# EAGLE design MoodLightv21 (EAGLE 5.04)
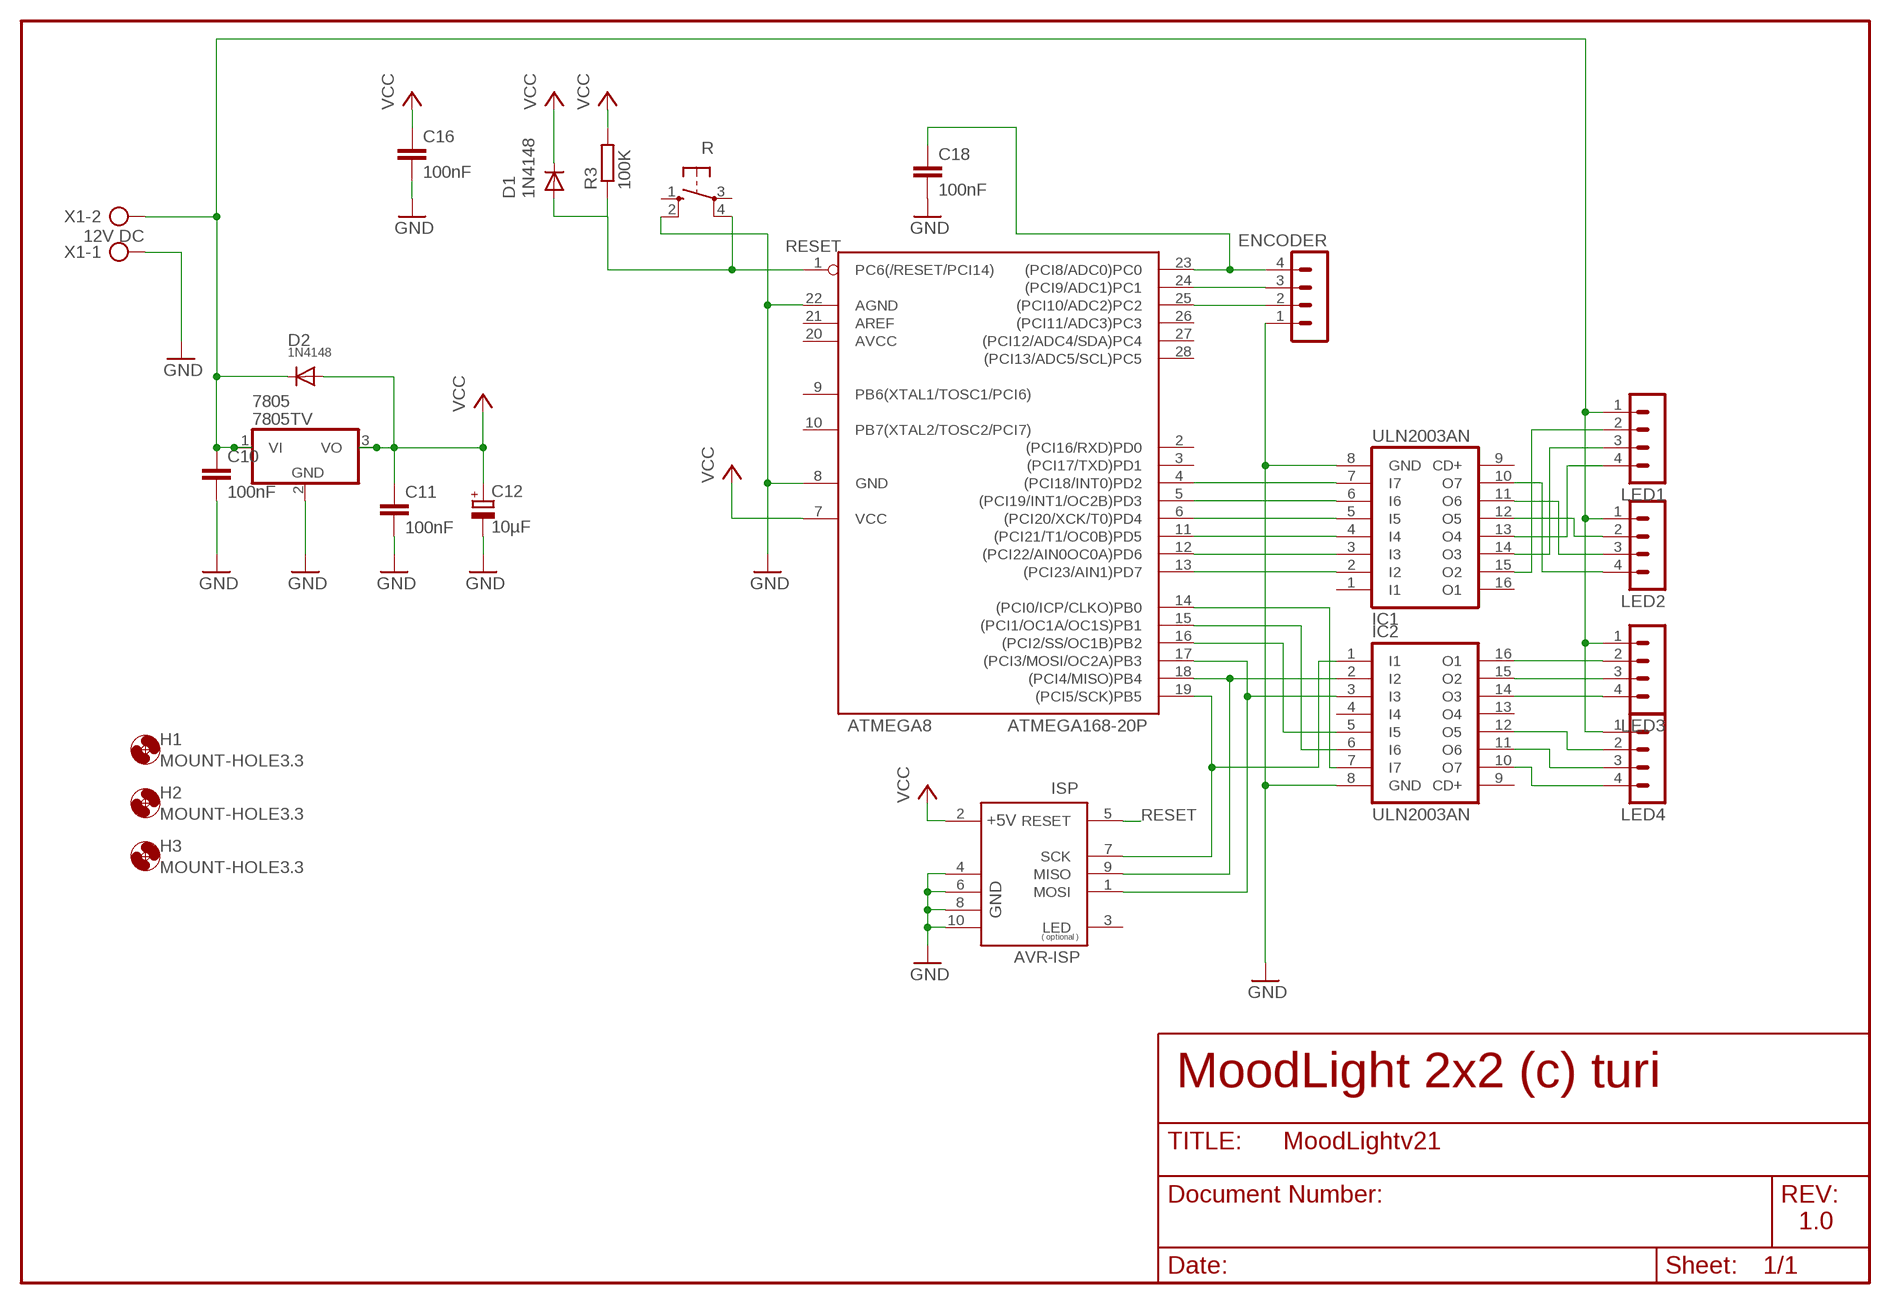
[diagram p0: schematic, sheet 1]

## Parts
7805  7805TV  [TO220V]
ATMEGA8  ATMEGA168-20P  [DIL28-3]
C10  100nF  C-EU025-024X044  [C025-024X044]
C11  100nF  C-EU025-024X044  [C025-024X044]
C12  10µF  CPOL-EUE2.5-5  [E2,5-5]
C16  100nF  C-EU025-024X044  [C025-024X044]
C18  100nF  C-EU025-024X044  [C025-024X044]
D1  1N4148  [DO35-10]
D2  1N4148  BAS15  [DO34-7]
ENCODER  MA04-1  [MA04-1]
H1  MOUNT-HOLE3.3  [3,3]
H2  MOUNT-HOLE3.3  [3,3]
H3  MOUNT-HOLE3.3  [3,3]
IC1  ULN2003AN  [DIL16]
IC2  ULN2003AN  [DIL16]
ISP  AVR-ISP  [ML10]
LED1  MA04-1  [MA04-1]
LED2  MA04-1  [MA04-1]
LED3  MA04-1  [MA04-1]
LED4  MA04-1  [MA04-1]
R  10-XX  [B3F-10XX]
R3  100K  R-EU_0207/10  [0207/10]
X1  12V DC  AK500/2  [AK500/2]

## Nets
GND: 7805.2(GND) ATMEGA8.8(GND) ATMEGA8.22(AGND) C10.2 C11.2 C12.- C16.2 C18.2 ENCODER.1 IC1.8(GND) IC2.8(GND) ISP.4(GND1) ISP.6(GND2) ISP.8(GND3) ISP.10(GND4) R.2(S1) X1.1
MISO: ATMEGA8.18((PCI4/MISO)PB4) IC2.2(I2) ISP.9(MISO)
MOSI: ATMEGA8.17((PCI3/MOSI/OC2A)PB3) IC2.3(I3) ISP.1(MOSI)
N$1: ATMEGA8.14((PCI0/ICP/CLKO)PB0) IC2.7(I7)
N$2: ATMEGA8.23((PCI8/ADC0)PC0) C18.1 ENCODER.4
N$3: ATMEGA8.15((PCI1/OC1A/OC1S)PB1) IC2.6(I6)
N$4: ATMEGA8.4((PCI18/INT0)PD2) IC1.7(I7)
N$5: ATMEGA8.5((PCI19/INT1/OC2B)PD3) IC1.6(I6)
N$6: ATMEGA8.6((PCI20/XCK/T0)PD4) IC1.5(I5)
N$7: ATMEGA8.11((PCI21/T1/OC0B)PD5) IC1.4(I4)
N$8: ATMEGA8.13((PCI23/AIN1)PD7) IC1.2(I2)
N$10: ATMEGA8.16((PCI2/SS/OC1B)PB2) IC2.5(I5)
N$11: 7805.1(VI) C10.1 D2.C LED1.1 LED2.1 LED3.1 LED4.1 X1.2
N$12: IC1.15(O2) LED1.2
N$13: IC1.14(O3) LED1.3
N$14: IC1.13(O4) LED1.4
N$15: IC1.12(O5) LED2.2
N$16: IC1.11(O6) LED2.3
N$17: IC1.10(O7) LED2.4
N$18: IC2.16(O1) LED3.2
N$19: IC2.15(O2) LED3.3
N$20: ATMEGA8.12((PCI22/AIN0OC0A)PD6) IC1.3(I3)
N$21: IC2.14(O3) LED3.4
N$22: IC2.12(O5) LED4.2
N$23: IC2.11(O6) LED4.3
N$24: IC2.10(O7) LED4.4
N$25: ATMEGA8.24((PCI9/ADC1)PC1) ENCODER.3
N$26: ATMEGA8.25((PCI10/ADC2)PC2) ENCODER.2
RESET: ATMEGA8.1(PC6(/RESET/PCI14)) D1.A ISP.5(RESET) R3.1 R.4(P1)
SCK: ATMEGA8.19((PCI5/SCK)PB5) IC2.1(I1) ISP.7(SCK)
VCC: 7805.3(VO) ATMEGA8.7(VCC) C11.1 C12.+ C16.1 D1.C D2.A ISP.2(+5V) R3.2
Unconnected: ATMEGA8.2((PCI16/RXD)PD0) ATMEGA8.3((PCI17/TXD)PD1) ATMEGA8.9(PB6(XTAL1/TOSC1/PCI6)) ATMEGA8.10(PB7(XTAL2/TOSC2/PCI7)) ATMEGA8.20(AVCC) ATMEGA8.21(AREF) ATMEGA8.26((PCI11/ADC3)PC3) ATMEGA8.27((PCI12/ADC4/SDA)PC4) ATMEGA8.28((PCI13/ADC5/SCL)PC5) IC1.1(I1) IC1.9(CD+) IC1.16(O1) IC2.4(I4) IC2.9(CD+) IC2.13(O4) R.1(S) R.3(P)

## Notes on the sheet
- MoodLight 2x2 (c) turi
- 1.0

## Power pins joined to a net without a drawn wire
LED: ISP.3(LED)

## Library data of the parts
7805 = linear:78*: Positive VOLTAGE REGULATOR Source: http://cache.national.com/ds/LM/LM78L05.pdf http://www.fairchildsemi.com/ds/LM/LM7805.pdf
ATMEGA8 = avr:ATMEGA168*P: MICROCONTROLLER 16 kBytes FLASH 1 kBytes SRAM 512 Bytes EEPROM USART 8-channel 10 bit ADC
C10 C11 C16 C18 = rcl:C-EU: CAPACITOR, European symbol
C12 = rcl:CPOL-EU: POLARIZED CAPACITOR, European symbol
D1 = diode:1N4148: DIODE high speed (Philips)
D2 = diode:BAS15: DIODE high speed
ENCODER LED1-LED4 = con-lstb:MA04-1: PIN HEADER
H1-H3 = holes:MOUNT-HOLE: MOUNTING HOLE with drill center marker
IC1 IC2 = uln-udn:ULN2003A: DRIVER ARRAY
ISP = roboternetz-definitionen:AVR-ISP
R = switch-omron:10-XX: OMRON SWITCH
R3 = rcl:R-EU_: RESISTOR, European symbol
X1 = con-ptr500:AK500/2: CONNECTOR

## Board
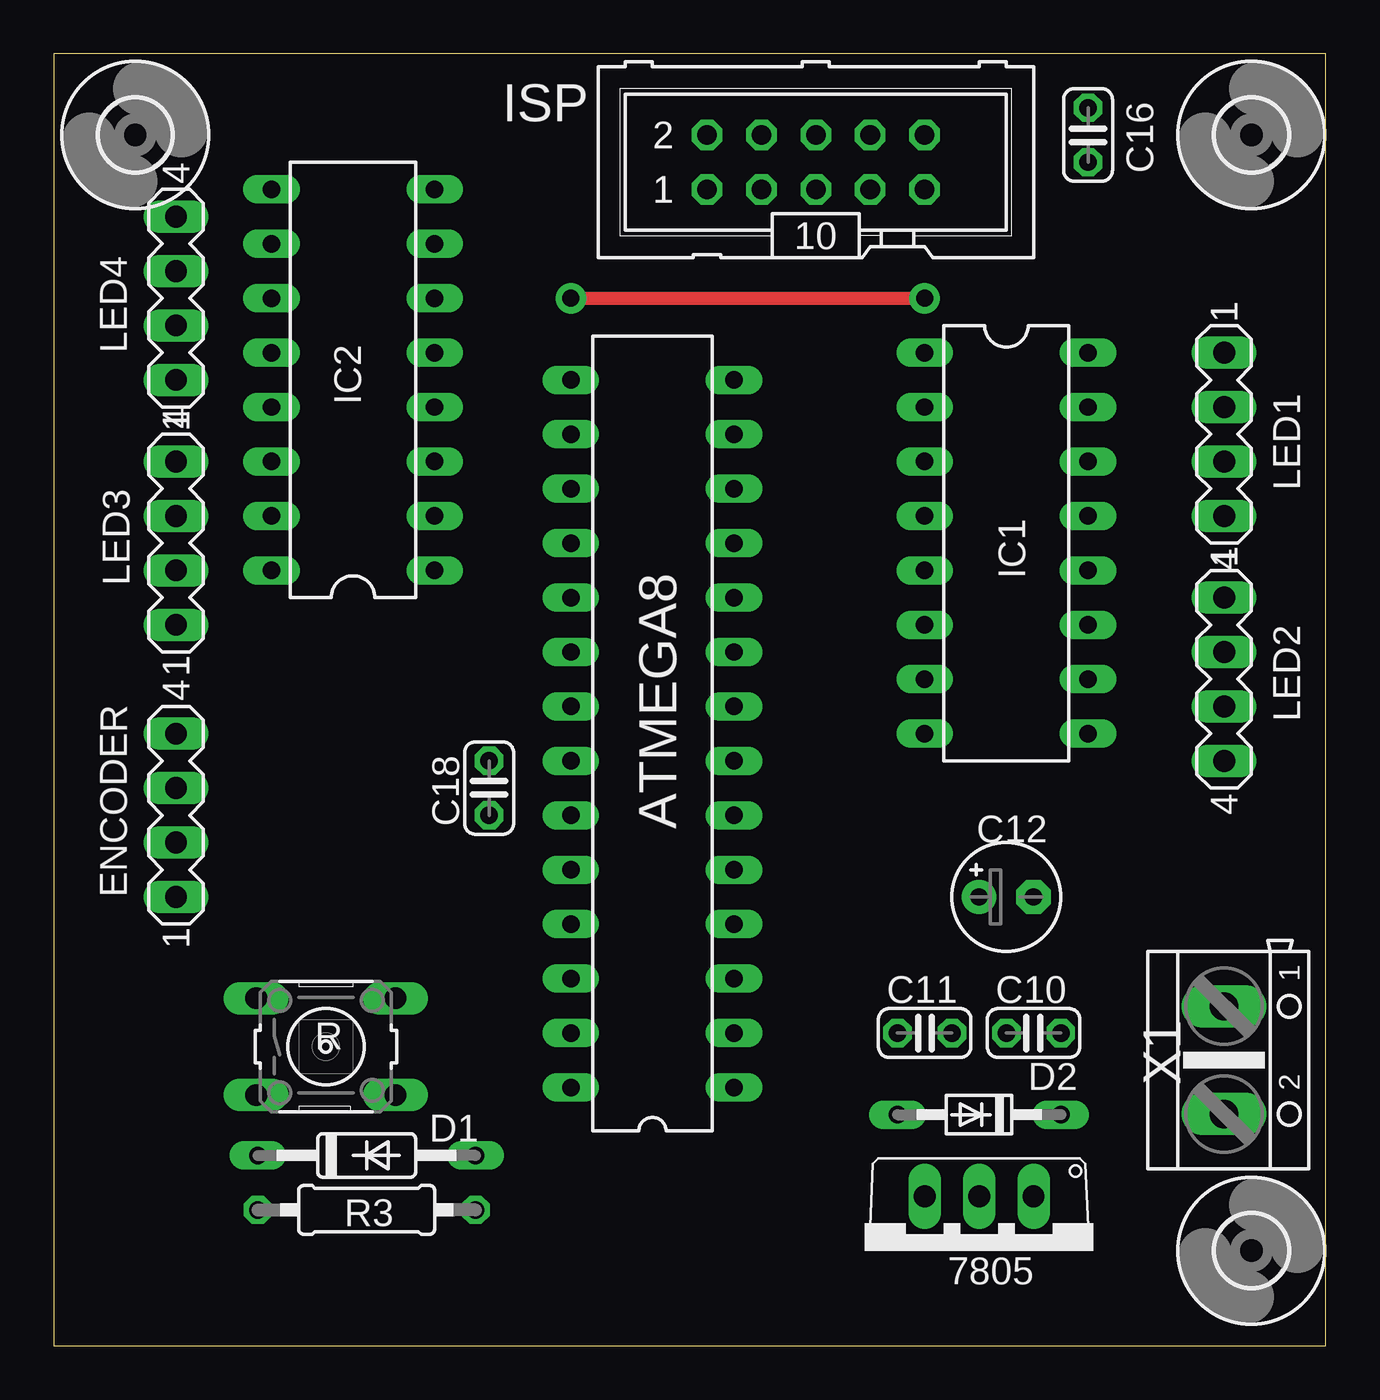
[diagram p1: board, top side]
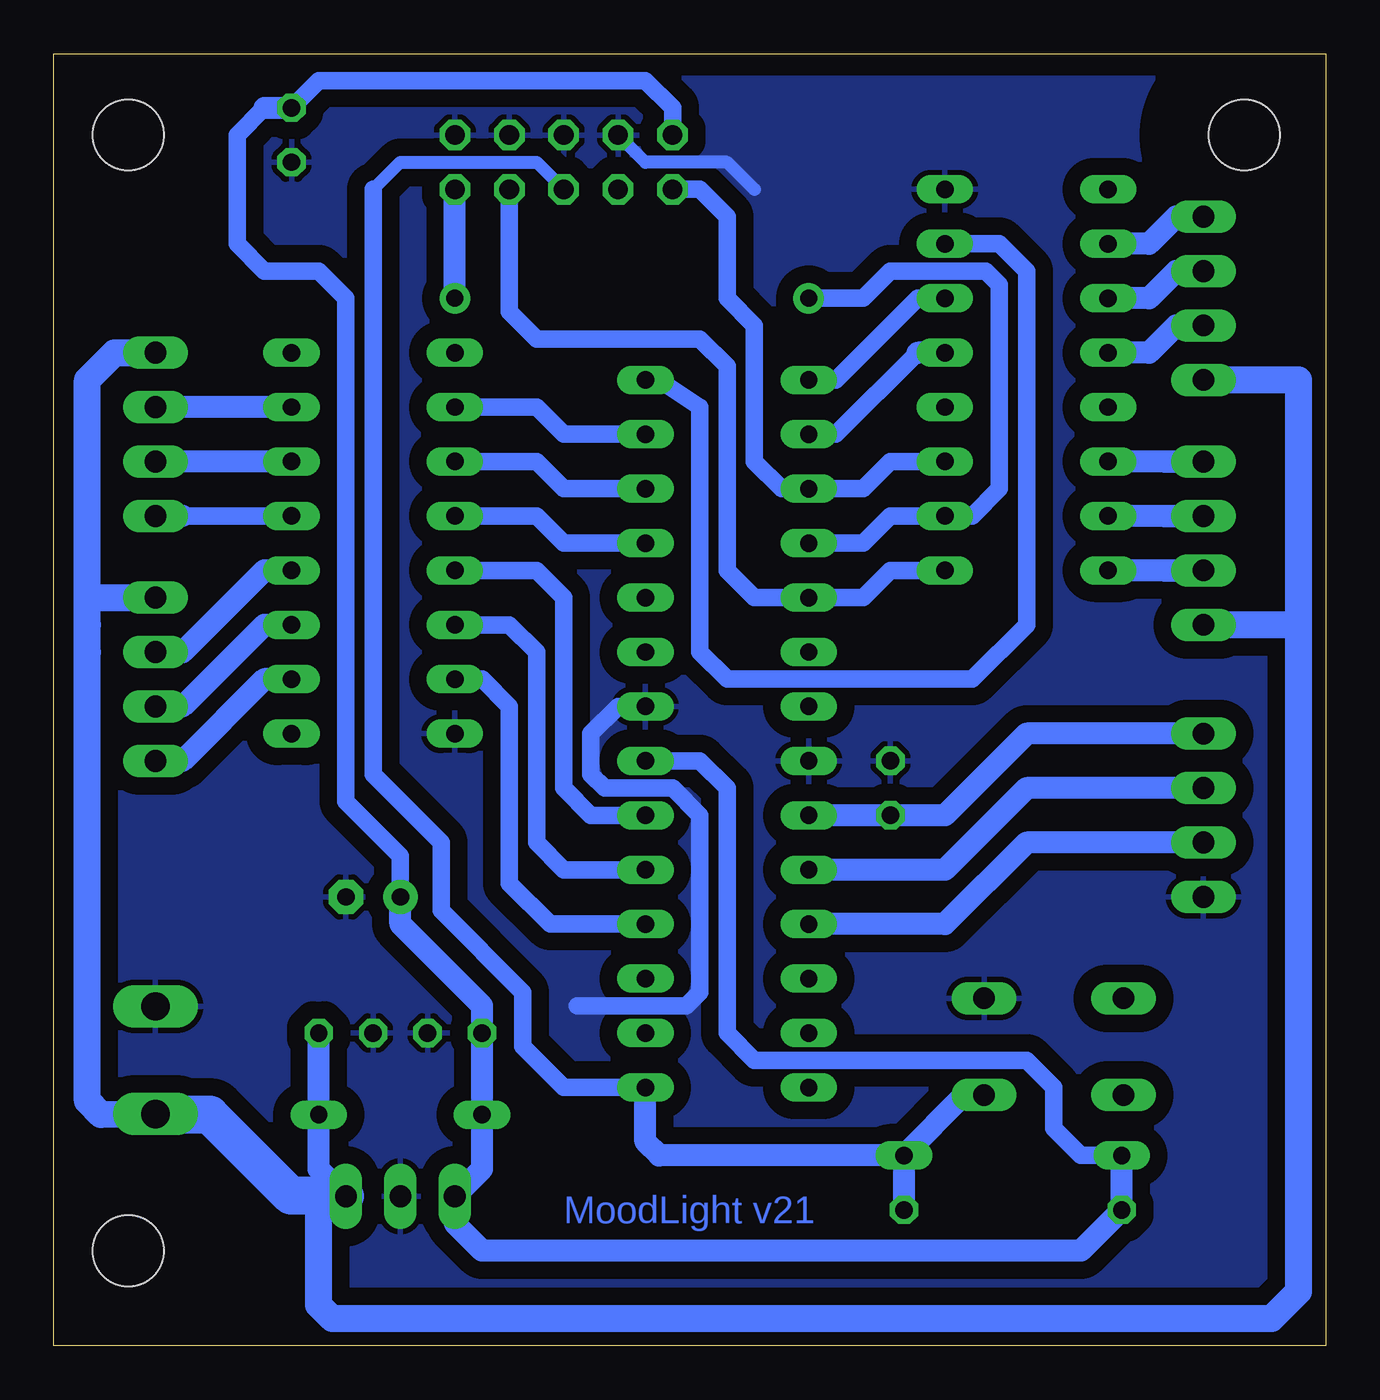
[diagram p2: board, bottom side, seen from below]

Size 59.36 x 60.31 mm. Coordinates in mm from the lower left corner, seen from the top.
Outline: 0,0 59.36,0 59.36,60.31 0,60.31 0,0
Copper layers (1*16): Top 0.035mm / dielectric 1.5mm / Bottom 0.035mm
Design rules "default": minimum track width 10mil, minimum drill 24mil, track to track 8mil, track to pad 8mil, pad to pad 8mil, via to via 8mil, smd to smd 8mil, copper to edge 40mil, drill to drill 8mil, minimum pad ring 10mil, minimum via ring 8mil, stop-mask expansion 4mil, vias tented up to drill 0mil, thermal gap 10mil

### Footprints (pad centres in the part's own frame; a part is rotated, then mirrored left to right if it is on the bottom)
TO220V = drill 1.016 long: 1 -2.54,-2.54; 2 0,-2.54; 3 2.54,-2.54
DIL28-3 = drill 0.813 long: 1 -16.51,-3.81; 2 -13.97,-3.81; 3 -11.43,-3.81; 4 -8.89,-3.81; 5 -6.35,-3.81; 6 -3.81,-3.81; 7 -1.27,-3.81; 8 1.27,-3.81; 9 3.81,-3.81; 10 6.35,-3.81; 11 8.89,-3.81; 12 11.43,-3.81; 13 13.97,-3.81; 14 16.51,-3.81; 15 16.51,3.81; 16 13.97,3.81; 17 11.43,3.81; 18 8.89,3.81; 19 6.35,3.81; 20 3.81,3.81; 21 1.27,3.81; 22 -1.27,3.81; 23 -3.81,3.81; 24 -6.35,3.81; 25 -8.89,3.81; 26 -11.43,3.81; 27 -13.97,3.81; 28 -16.51,3.81
C025-024X044 = drill 0.813 octagon: 1 -1.27,0; 2 1.27,0
E2,5-5 = drill 0.813 pad 1.6 round: + -1.27,0 | drill 0.813 pad 1.6 octagon: - 1.27,0
DO35-10 = drill 0.813 long: A 5.08,0; C -5.08,0
DO34-7 = drill 0.813 long: A 3.81,0; C -3.81,0
MA04-1 = drill 1.016 long: 1 -3.81,0; 2 -1.27,0; 3 1.27,0; 4 3.81,0
3,3 = hole 3.3: 0,0
DIL16 = drill 0.813 long: 1 -8.89,-3.81; 2 -6.35,-3.81; 3 -3.81,-3.81; 4 -1.27,-3.81; 5 1.27,-3.81; 6 3.81,-3.81; 7 6.35,-3.81; 8 8.89,-3.81; 9 8.89,3.81; 10 6.35,3.81; 11 3.81,3.81; 12 1.27,3.81; 13 -1.27,3.81; 14 -3.81,3.81; 15 -6.35,3.81; 16 -8.89,3.81
ML10 = drill 0.914 octagon: 1 -5.08,-1.27; 2 -5.08,1.27; 3 -2.54,-1.27; 4 -2.54,1.27; 5 0,-1.27; 6 0,1.27; 7 2.54,-1.27; 8 2.54,1.27; 9 5.08,-1.27; 10 5.08,1.27
B3F-10XX = drill 1.016 long: 1 -3.251,2.261; 2 3.251,2.261; 3 -3.251,-2.261; 4 3.251,-2.261
0207/10 = drill 0.813 octagon: 1 -5.08,0; 2 5.08,0
AK500/2 = drill 1.321 long: 1 -2.515,0; 2 2.515,0

### Placement (x,y rotation side)
7805  43.18,4.44 180 top
ATMEGA8  27.94,28.58 90 top
C10  45.72,14.61 180 top
C11  40.64,14.61 0 top
C12  44.45,20.96 0 top
C16  48.26,56.52 270 top
C18  20.32,26.04 90 top
D1  14.61,8.89 0 top
D2  43.18,10.8 180 top
ENCODER  5.71,24.77 90 top
H1  3.81,56.52 0 top
H2  55.88,4.44 0 top
H3  55.88,56.52 0 top
IC1  44.45,37.47 270 top
IC2  13.97,45.09 90 top
ISP  35.56,55.24 0 top
LED1  54.61,42.55 270 top
LED2  54.61,31.12 270 top
LED3  5.71,37.47 90 top
LED4  5.71,48.9 90 top
R  12.7,13.97 0 top
R3  14.61,6.35 180 top
X1  54.61,13.34 270 top

### Tracks (layer width: path | path; a pad name or v marks a point on that pad's centre or on a via)
GND
  Bottom 0.61: ISP.4 31.75,55.24 27.94,55.24 26.67,53.98
  Bottom 0.813: ATMEGA8.8 33.02,29.84 34.29,28.58 34.29,26.67 33.65,26.04 30.48,26.04 29.21,24.77 29.21,16.51 29.84,15.88 34.92,15.88
  pour Bottom (isolate 0.813): 0,60.33 59.69,60.33 59.69,-0.64 0,-0.64 0,0.63
MISO  (via drill 0.8 pad 1.42)
  Top 0.61: v24.13,48.9 v40.64,48.9
  Bottom 0.813: ATMEGA8.18 21.59,37.47 20.32,38.73 IC2.2 16.51,38.73 15.24,40.01 15.24,49.53 15.88,50.16 20.32,50.16 21.59,48.9 v24.13,48.9
  Bottom 1.016: v40.64,48.9 ISP.9
MOSI
  Bottom 0.61: ATMEGA8.17 25.4,40.01
  Bottom 0.813: 25.4,40.01 26.67,41.27 26.67,47.62 27.94,48.9 27.94,52.7 29.21,53.98 ISP.1 | ATMEGA8.17 21.59,40.01 20.32,41.27 IC2.3
N$1
  Bottom 0.813: ATMEGA8.14 31.11,45.09 29.21,43.81 29.21,32.38 27.94,31.12 16.51,31.12 13.97,33.66 13.97,50.16 15.24,51.44 IC2.7
N$2
  Bottom 1.016: ATMEGA8.23 C18.1 17.78,24.77 13.97,28.58 ENCODER.4
N$3
  Bottom 0.813: ATMEGA8.15 22.86,45.09 19.05,48.9 IC2.6
N$4
  Bottom 0.813: ATMEGA8.4 36.2,19.69 38.1,21.59 38.1,29.84 39.37,31.12 IC1.7
N$5
  Bottom 0.813: ATMEGA8.5 35.56,22.23 36.83,23.5 36.83,32.38 38.1,33.66 IC1.6
N$6
  Bottom 0.813: ATMEGA8.6 34.29,24.77 35.56,26.04 35.56,34.92 36.83,36.2 IC1.5
N$7
  Bottom 0.813: ATMEGA8.11 35.56,37.47 36.83,38.73 IC1.4
N$8
  Bottom 0.813: ATMEGA8.13 35.56,42.55 36.83,43.81 IC1.2
N$10
  Bottom 0.813: ATMEGA8.16 22.86,42.55 19.05,46.36
  Bottom 1.016: IC2.5 19.05,46.36
N$11
  Bottom 1.016: 45.74,7.01 46.99,8.25 D2.C C10.1
  Bottom 1.27: 57.78,32.38 57.78,11.43 57.15,10.8 X1.2 | 57.78,32.38 57.78,33.66 | 57.78,32.38 57.78,34.92 | 57.78,34.92 57.78,45.09 56.51,46.36 LED1.1 | 1.27,33.66 1.27,45.09 LED4.1 | 1.27,33.66 1.27,2.54 2.54,1.27 46.35,1.27 46.99,1.91 46.99,7.01 | 1.27,33.66 LED3.1 | 57.78,34.92 LED2.1
  Bottom 1.676: 46.99,7.01 45.74,7.01 7805.1
  Bottom 1.778: 46.99,7.01 48.28,7.01 52.07,10.8 54.58,10.8 X1.2
N$12
  Bottom 1.016: IC1.15 LED1.2
N$13
  Bottom 1.016: IC1.14 LED1.3
N$14
  Bottom 0.813: IC1.13 53.34,38.73
  Bottom 1.016: 53.34,38.73 LED1.4
N$15
  Bottom 1.016: IC1.12 49.53,36.2 53.34,32.38 LED2.2
N$16
  Bottom 1.016: IC1.11 49.53,33.66 53.34,29.84 LED2.3
N$17
  Bottom 1.016: IC1.10 49.53,31.12 53.34,27.3 LED2.4
N$18
  Bottom 1.016: 7.62,36.2 6.35,36.2 | 7.62,36.2 IC2.16 | LED3.2 7.62,36.2
N$19
  Bottom 1.016: 7.62,38.73 6.35,38.73 | 7.62,38.73 IC2.15 | LED3.3 7.62,38.73
N$20
  Bottom 0.813: ATMEGA8.12 35.56,40.01 36.83,41.27 IC1.3
N$21
  Bottom 1.016: 7.62,41.27 6.35,41.27 | 7.62,41.27 IC2.14 | LED3.4 7.62,41.27
N$22
  Bottom 1.016: IC2.12 8.26,46.36 6.99,47.62 LED4.2
N$23
  Bottom 1.016: IC2.11 8.26,48.9 6.99,50.16 LED4.3
N$24
  Bottom 1.016: IC2.10 8.26,51.44 6.99,52.7 LED4.4
N$25
  Bottom 1.016: ATMEGA8.24 17.78,22.23 13.97,26.04 ENCODER.3
N$26
  Bottom 1.016: ATMEGA8.25 17.78,19.69 13.97,23.5 ENCODER.2
RESET
  Bottom 0.61: 44.45,53.98 43.18,55.24 36.83,55.24 ISP.5
  Bottom 0.813: ATMEGA8.1 35.56,12.07 37.46,13.97 37.46,16.51 41.27,20.32 41.27,23.5 44.45,26.67 44.45,53.98
  Bottom 1.016: ATMEGA8.1 31.75,9.53 31.11,8.89 D1.A | R3.1 D1.A | R.4 16.87,11.71 D1.A
SCK
  Bottom 0.813: ISP.7 38.1,48.26 36.83,46.99 29.21,46.99 27.94,45.72 27.94,36.2 26.67,34.92 ATMEGA8.19 21.59,34.92 20.32,36.2 IC2.1
VCC
  Bottom 0.813: ISP.2 30.48,57.78 31.75,59.06 46.99,59.06 C16.1 | 40.64,5.71 7805.3 | ATMEGA8.7 29.21,27.3 27.94,26.04 27.94,14.61 26.67,13.34 13.97,13.34 12.7,12.07 12.7,10.16 11.43,8.89 D1.C | 49.53,57.78 50.8,56.52 50.8,51.44 49.53,50.16 46.99,50.16 45.72,48.9 45.72,25.4 43.18,22.86 C12.+
  Bottom 1.016: R3.2 D1.C R3.2 | 7805.3 39.37,8.25 D2.A C11.1 39.37,15.88 43.18,19.69 C12.+ | R3.2 11.43,4.44 39.37,4.44 40.64,5.71 | 49.53,57.78 C16.1

### Text on the board
Bottom: MoodLight v21